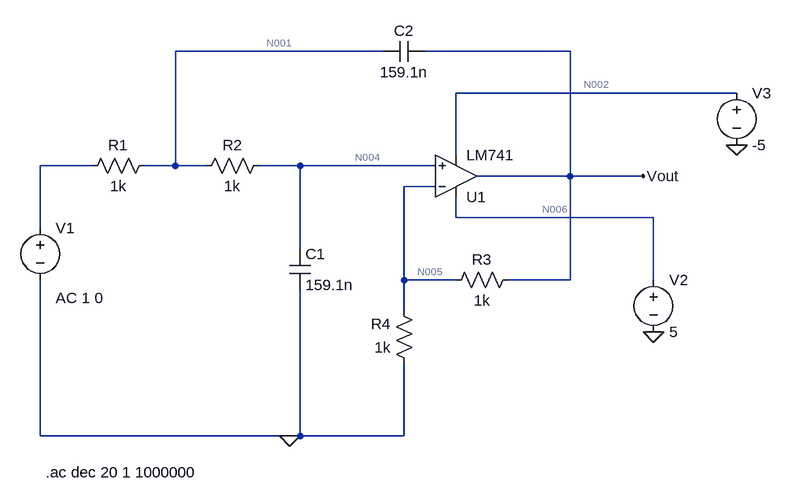
[diagram p0: schematic sallen_key.asc]
sallen_key.asc, the LTspice schematic file:
Version 4
SHEET 1 1256 680
WIRE 656 -160 336 -160
WIRE 944 -160 720 -160
WIRE 1200 -96 768 -96
WIRE 768 0 768 -96
WIRE 208 16 128 16
WIRE 336 16 336 -160
WIRE 336 16 288 16
WIRE 384 16 336 16
WIRE 528 16 464 16
WIRE 736 16 528 16
WIRE 944 32 944 -160
WIRE 944 32 800 32
WIRE 1056 32 944 32
WIRE 736 48 688 48
WIRE 768 96 768 64
WIRE 1072 96 768 96
WIRE 128 112 128 16
WIRE 528 144 528 16
WIRE 688 192 688 48
WIRE 768 192 688 192
WIRE 944 192 944 32
WIRE 944 192 848 192
WIRE 1072 192 1072 96
WIRE 688 240 688 192
WIRE 128 432 128 192
WIRE 512 432 128 432
WIRE 528 432 528 208
WIRE 528 432 512 432
WIRE 688 432 688 320
WIRE 688 432 528 432
FLAG 512 432 0
FLAG 1056 32 Vout
FLAG 1072 272 0
FLAG 1200 -16 0
SYMBOL voltage 128 96 R0
WINDOW 123 24 124 Left 2
WINDOW 39 0 0 Left 0
SYMATTR Value2 AC 1 0
SYMATTR InstName V1
SYMATTR Value ""
SYMBOL res 304 0 R90
WINDOW 0 0 56 VBottom 2
WINDOW 3 32 56 VTop 2
SYMATTR InstName R1
SYMATTR Value 1k
SYMBOL res 480 0 R90
WINDOW 0 0 56 VBottom 2
WINDOW 3 32 56 VTop 2
SYMATTR InstName R2
SYMATTR Value 1k
SYMBOL res 864 176 R90
WINDOW 0 0 56 VBottom 2
WINDOW 3 32 56 VTop 2
SYMATTR InstName R3
SYMATTR Value 1k
SYMBOL res 704 336 R180
WINDOW 0 36 76 Left 2
WINDOW 3 36 40 Left 2
SYMATTR InstName R4
SYMATTR Value 1k
SYMBOL cap 512 144 R0
SYMATTR InstName C1
SYMATTR Value 159.1n
SYMBOL cap 720 -176 R90
WINDOW 0 0 32 VBottom 2
WINDOW 3 32 32 VTop 2
SYMATTR InstName C2
SYMATTR Value 159.1n
SYMBOL LM741 768 96 M180
SYMATTR InstName U1
SYMBOL voltage 1072 176 R0
WINDOW 123 0 0 Left 0
WINDOW 39 0 0 Left 0
SYMATTR InstName V2
SYMATTR Value 5
SYMBOL voltage 1200 -112 R0
SYMATTR InstName V3
SYMATTR Value -5
TEXT 136 488 Left 2 !.ac dec 20 1 1000000

The netlist it stands for:
* sallen_key.asc
V1 N003 0 AC 1 0
R1 N001 N003 1k
R2 N004 N001 1k
R3 Vout N005 1k
R4 0 N005 1k
C1 N004 0 159.1n
C2 Vout N001 159.1n
XU1 N004 N005 N006 N002 Vout LM741  ; pins In+ In- V+ V- OUT
V2 N006 0 5
V3 N002 0 -5
.ac dec 20 1 1000000
.lib LM741.lib
.backanno
.end

* Results of the author's LTspice run, read from the files saved beside the schematic
* Operating Point, zero values left out:
*   V(n001) = -57.87 µV
*   V(n004) = -115.7 µV
*   V(vout) = 1.87 mV
*   V(n005) = 884.3 µV
*   V(n002) = -5 V
*   V(n006) = 5 V
*   I(R4) = -884.3 nA
*   I(R3) = 986.1 nA
*   I(R2) = -57.87 nA
*   I(R1) = -57.87 nA
*   I(V3) = 1.451 mA
*   I(V2) = -1.452 mA
*   I(V1) = -57.87 nA
*   Ix(u1:1) = 57.87 nA
*   Ix(u1:2) = 101.9 nA
*   Ix(u1:99) = 1.452 mA
*   Ix(u1:50) = -1.451 mA
*   Ix(u1:28) = -986.1 nA
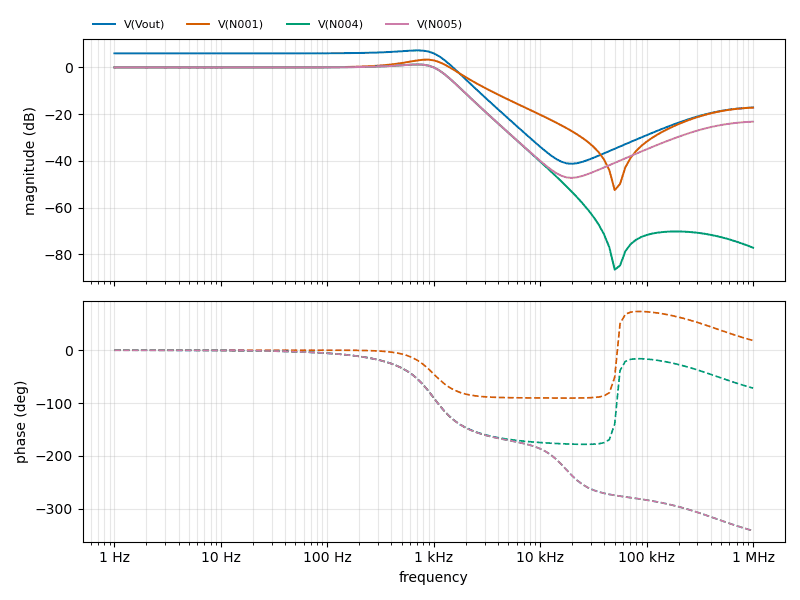
[diagram p1: AC Analysis of sallen_key.asc, plotted from the saved traces]
* AC Analysis, 1 run:
*   V(Vout): 6.02 dB at 1 Hz, -17.19 dB at 1 MHz, peak 7.28 dB at 707.9 Hz, 3 dB below the peak at 1.164 kHz
*   V(N001): 0.00 dB at 1 Hz, -17.21 dB at 1 MHz, peak 3.32 dB at 891.3 Hz, 3 dB below the peak at 191 Hz and 1.372 kHz
*   V(N004): 0.00 dB at 1 Hz, -77.19 dB at 1 MHz, peak 1.26 dB at 707.9 Hz, 3 dB below the peak at 1.164 kHz
*   V(N005): 0.00 dB at 1 Hz, -23.22 dB at 1 MHz, peak 1.26 dB at 707.9 Hz, 3 dB below the peak at 1.164 kHz